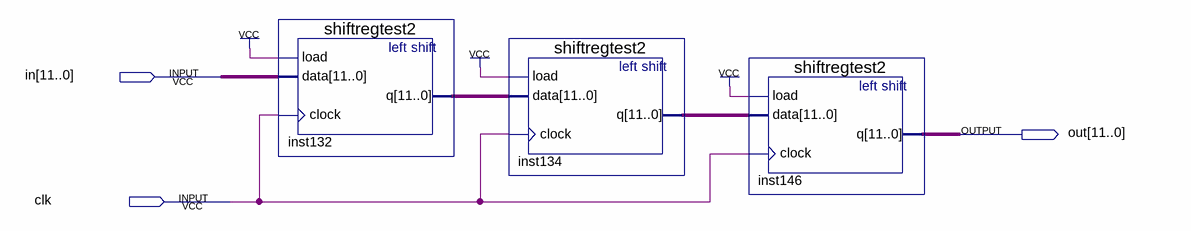
[diagram p0: schematic sheet]
// Quartus schematic threeSampleDelay.bdf as structural Verilog: 3 symbols, 3 pins
module threeSampleDelay (
  input  [11:0] in,
  input  clk,
  output [11:0] out
);

  wire [11:0] inst132_q, inst134_q;

  shiftregtest2 inst132 (.load(1'b1), .data(in), .clock(clk), .q(inst132_q));
  shiftregtest2 inst134 (.load(1'b1), .data(inst132_q), .clock(clk), .q(inst134_q));
  shiftregtest2 inst146 (.load(1'b1), .data(inst134_q), .clock(clk), .q(out));
endmodule
